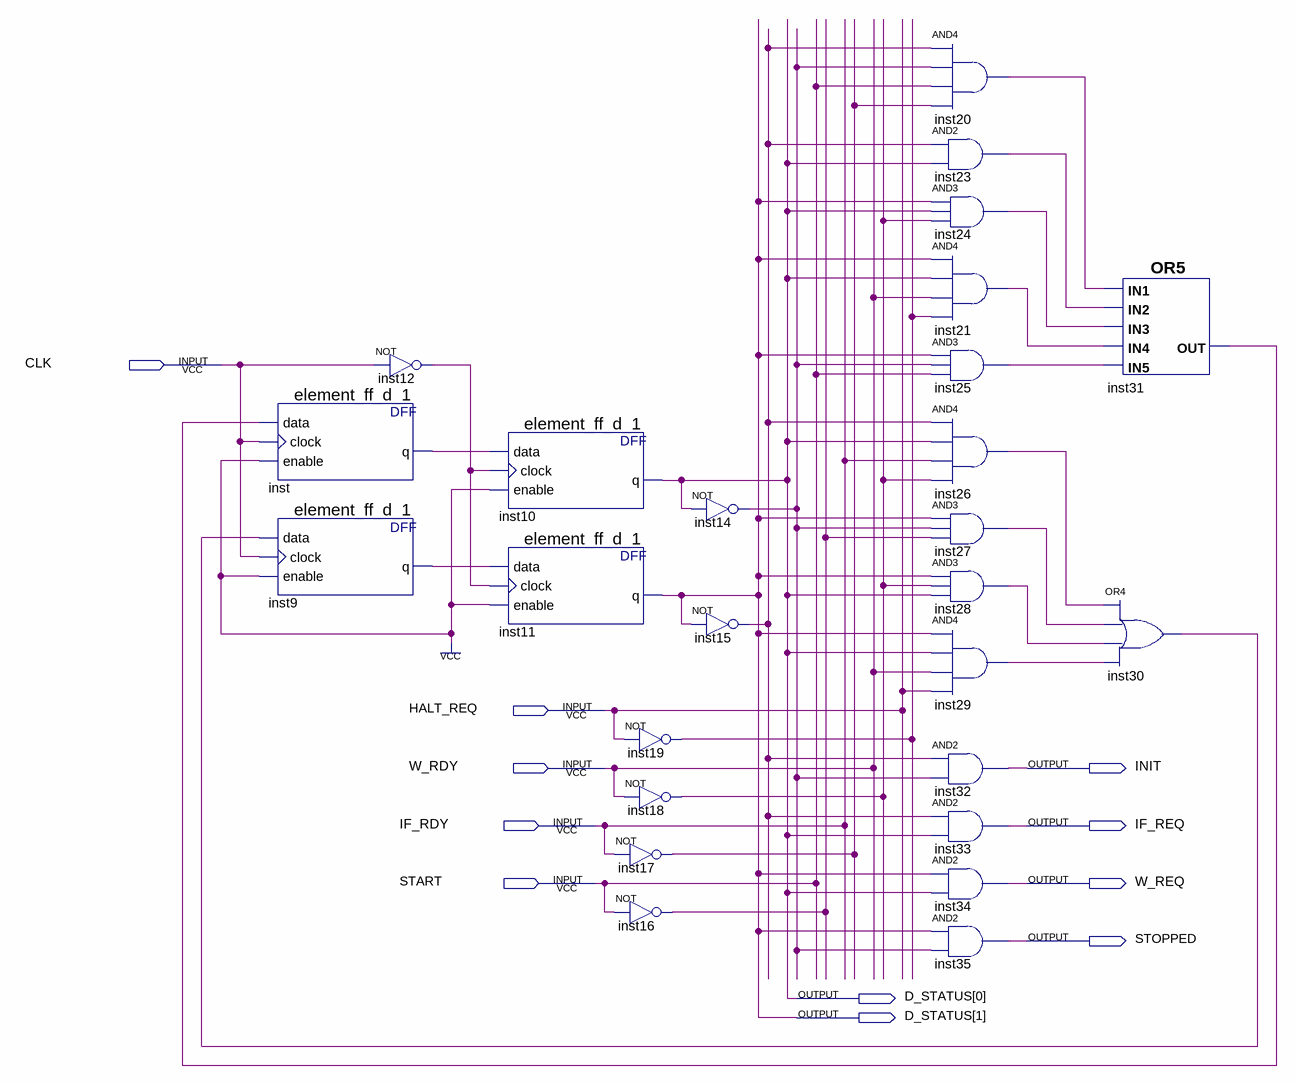
[diagram p0: schematic sheet]
// Quartus schematic block-control-state-machine.bdf as structural Verilog: 26 symbols, 11 pins
module \block-control-state-machine  (
  input  CLK,
  input  HALT_REQ,
  input  W_RDY,
  input  IF_RDY,
  input  START,
  output INIT,
  output IF_REQ,
  output W_REQ,
  output STOPPED,
  output [1:0] D_STATUS
);

  wire inst9_q, inst12_out, inst14_out, inst15_out, inst16_out, inst17_out, inst18_out, inst19_out,
       inst20_out, inst21_out, inst23_out, inst24_out, inst25_out, inst26_out, inst27_out, inst28_out,
       inst29_out, inst30_out, inst31_out, inst_q;

  element_ff_d_1 inst (.data(inst31_out), .clock(CLK), .enable(1'b1), .q(inst_q));
  element_ff_d_1 inst9 (.data(inst30_out), .clock(CLK), .enable(1'b1), .q(inst9_q));
  not inst12 (inst12_out, CLK);
  element_ff_d_1 inst10 (.data(inst_q), .clock(inst12_out), .enable(1'b1), .q(D_STATUS[0]));
  element_ff_d_1 inst11 (.data(inst9_q), .clock(inst12_out), .enable(1'b1), .q(D_STATUS[1]));
  not inst19 (inst19_out, HALT_REQ);
  not inst18 (inst18_out, W_RDY);
  not inst17 (inst17_out, IF_RDY);
  not inst16 (inst16_out, START);
  not inst14 (inst14_out, D_STATUS[0]);
  not inst15 (inst15_out, D_STATUS[1]);
  and inst20 (inst20_out, inst15_out, inst14_out, START, inst17_out);
  and inst23 (inst23_out, inst15_out, D_STATUS[0]);
  and inst24 (inst24_out, D_STATUS[1], D_STATUS[0], inst18_out);
  and inst21 (inst21_out, D_STATUS[1], D_STATUS[0], W_RDY, inst19_out);
  and inst25 (inst25_out, D_STATUS[1], inst14_out, START);
  and inst26 (inst26_out, inst15_out, D_STATUS[0], IF_RDY, inst18_out);
  and inst27 (inst27_out, D_STATUS[1], inst14_out, inst16_out);
  and inst28 (inst28_out, D_STATUS[1], inst18_out, D_STATUS[0]);
  and inst29 (inst29_out, D_STATUS[1], D_STATUS[0], W_RDY, HALT_REQ);
  and inst32 (INIT, inst15_out, inst14_out);
  and inst33 (IF_REQ, inst15_out, D_STATUS[0]);
  and inst34 (W_REQ, D_STATUS[1], D_STATUS[0]);
  and inst35 (STOPPED, D_STATUS[1], inst14_out);
  or inst31 (inst31_out, inst20_out, inst23_out, inst24_out, inst21_out, inst25_out);
  or inst30 (inst30_out, inst26_out, inst27_out, inst28_out, inst29_out);
endmodule
